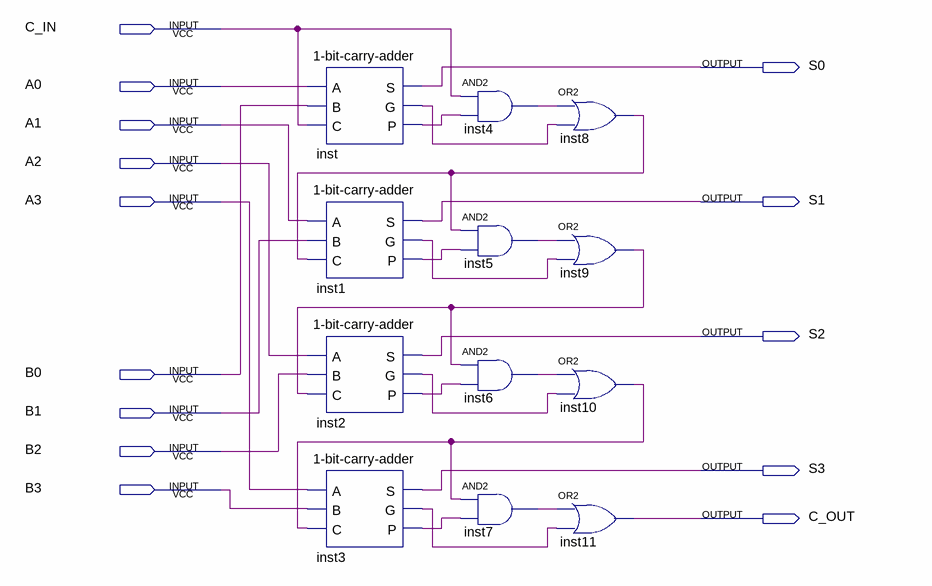
[diagram p0: schematic sheet]
// Quartus schematic 4-bit-carry-lookahead-adder.bdf as structural Verilog: 12 symbols, 14 pins
module \4-bit-carry-lookahead-adder  (
  input  C_IN,
  input  A0,
  input  A1,
  input  A2,
  input  A3,
  input  B0,
  input  B1,
  input  B2,
  input  B3,
  output S0,
  output S1,
  output S2,
  output S3,
  output C_OUT
);

  wire inst1_g, inst1_p, inst2_g, inst2_p, inst3_g, inst3_p, inst4_out, inst5_out, inst6_out, inst7_out,
       inst8_out, inst9_out, inst10_out, inst_g, inst_p;

  \1-bit-carry-adder  inst (.A(A0), .B(B0), .C(C_IN), .S(S0), .G(inst_g), .P(inst_p));
  \1-bit-carry-adder  inst1 (.A(A1), .B(B1), .C(inst8_out), .S(S1), .G(inst1_g), .P(inst1_p));
  \1-bit-carry-adder  inst2 (.A(A2), .B(B2), .C(inst9_out), .S(S2), .G(inst2_g), .P(inst2_p));
  \1-bit-carry-adder  inst3 (.A(A3), .B(B3), .C(inst10_out), .S(S3), .G(inst3_g), .P(inst3_p));
  and inst4 (inst4_out, C_IN, inst_p);
  and inst5 (inst5_out, inst8_out, inst1_p);
  and inst6 (inst6_out, inst9_out, inst2_p);
  and inst7 (inst7_out, inst10_out, inst3_p);
  or inst8 (inst8_out, inst4_out, inst_g);
  or inst9 (inst9_out, inst5_out, inst1_g);
  or inst10 (inst10_out, inst6_out, inst2_g);
  or inst11 (C_OUT, inst7_out, inst3_g);
endmodule
